# Altium schematic sheet Thermosistor1.SchDoc
size A4; SheetNumber: 7; SheetTotal: 11
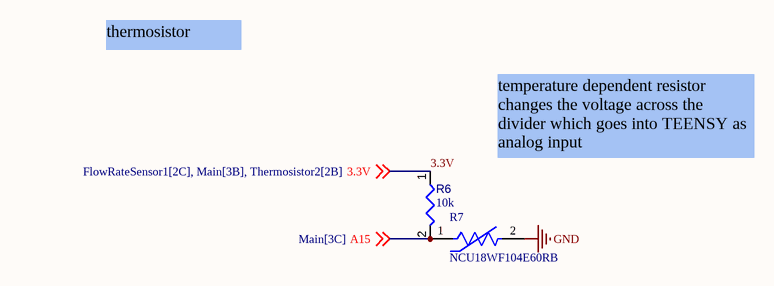
[diagram p0: Thermosistor1.SchDoc]

## Parts
R6  value 10k  [RESC0402(1005)_L]  (hidden comment: Resistor 10K  +/-1 % 0402 63 mW)
R7  NCU18WF104E60RB  [FP-NCU18-0_15-IPC_C]

## Nets
GND: R7.2
3.3V: R6.1 ; off-sheet 3.3V
A15: R6.2 R7.1 ; off-sheet A15

## Notes on the sheet
- thermosistor
- temperature dependent resistor changes the voltage across the divider which goes into TEENSY as analog input

## Library data of the parts
R6 = CMP-009-00149-3: Chip Resistor, 10 kOhms, +/-1 %, 63 mW, -55 to 125 degC, 0402; Power: 63mW; Tolerance: 1%; Min Operating Temperature: -55°C; Case/Package: 0402; Max Operating Temperature: 155°C; Pins: 2
R7 = CMP-06022-000229-2: THERMISTOR NTC